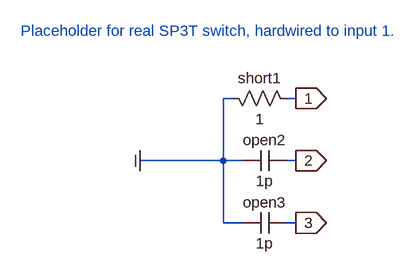
[diagram p0: schematic sp3t-1.asc]
sp3t-1.asc, the LTspice schematic file:
Version 4
SHEET 1 880 680
WIRE 144 64 128 64
WIRE 240 64 224 64
WIRE 128 160 128 64
WIRE 128 160 0 160
WIRE 160 160 128 160
WIRE 240 160 224 160
WIRE 128 256 128 160
WIRE 160 256 128 256
WIRE 240 256 224 256
FLAG 0 160 COM
IOPIN 0 160 In
FLAG 240 64 1
IOPIN 240 64 Out
FLAG 240 160 2
IOPIN 240 160 Out
FLAG 240 256 3
IOPIN 240 256 Out
SYMBOL res 128 48 M90
WINDOW 0 0 56 VBottom 0
WINDOW 3 32 56 VTop 0
SYMATTR InstName short1
SYMATTR Value 1
SYMBOL cap 224 144 R90
WINDOW 0 0 32 VBottom 0
WINDOW 3 32 32 VTop 0
SYMATTR InstName open2
SYMATTR Value 1p
SYMBOL cap 224 240 R90
WINDOW 0 0 32 VBottom 0
WINDOW 3 32 32 VTop 0
SYMATTR InstName open3
SYMATTR Value 1p
TEXT -184 -40 Left 0 ;Placeholder for real SP3T switch, hardwired to input 1.

The netlist it stands for:
* sp3t-1.asc
R§short1 COM 1 1
C§open2 2 COM 1p
C§open3 3 COM 1p
* Placeholder for real SP3T switch, hardwired to input 1.
.backanno
.end